# Altium schematic sheet MB1605-TOP.SchDoc: MB1605-TOP
size A3; Date: Not used; ApprovedBy: Not used; CheckedBy: Not used; Author: Not used; CompanyName: STMicroelectronics; DrawnBy: Not used; Engineer: Not used; Organization: Not used; Address1: Not used; Address2: Not used; Address3: Not used; Address4: Not used; DocumentNumber: Not used; Revision: Not used; SheetNumber: 2; SheetTotal: 18; CurrentTime: Not used; CurrentDate: Not used; Time: Not used; DocumentFullPathAndName: Not used; DocumentName: Not used; ModifiedDate: Not used; ImagePath: Not used; ProjectName: Not used; Application_BuildNumber: Not used
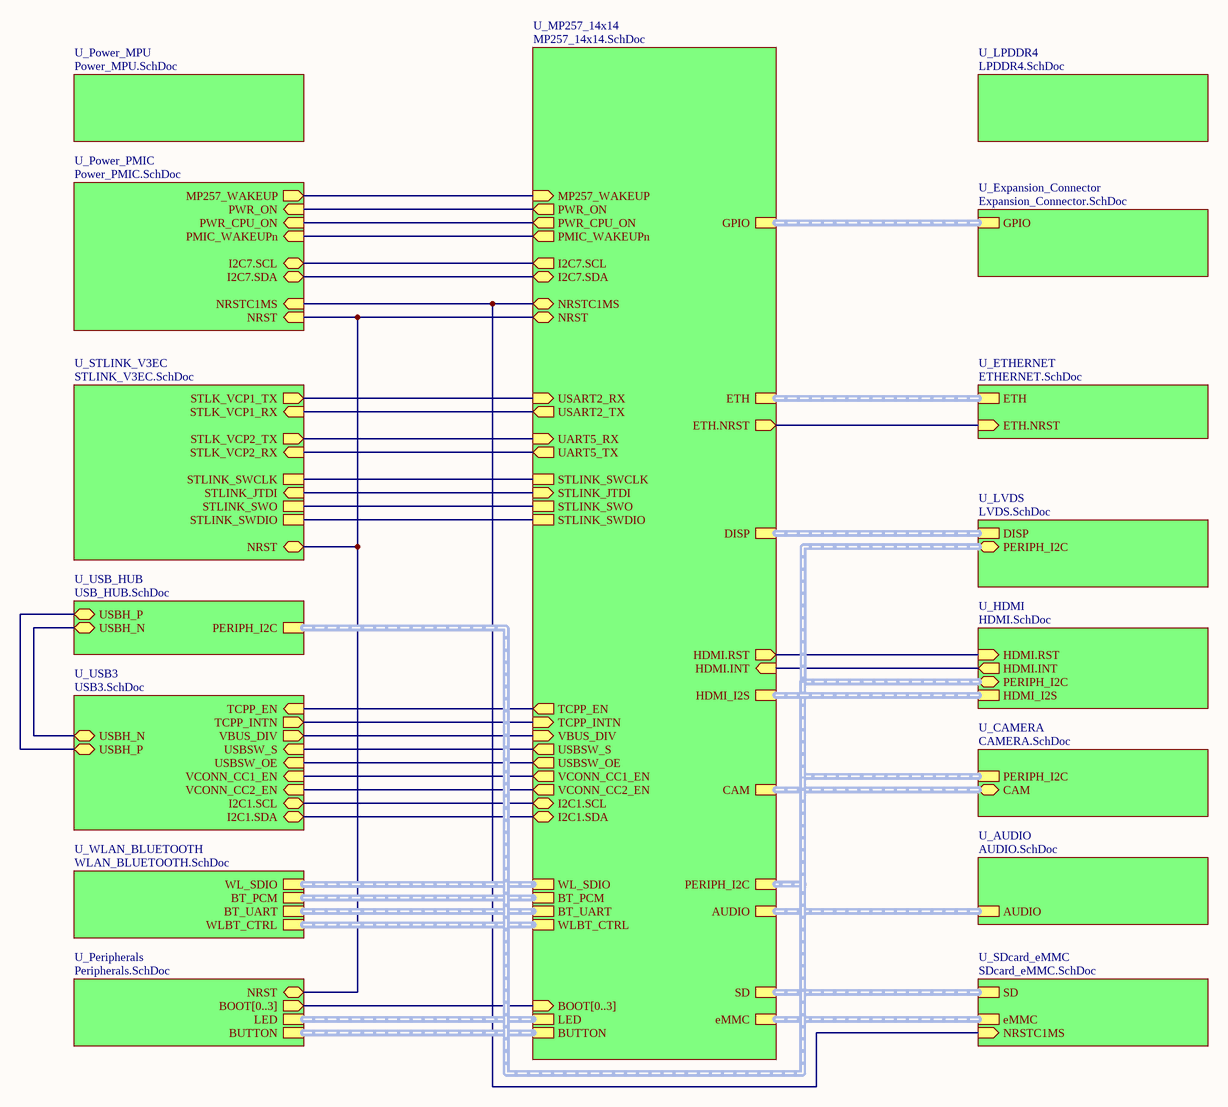
[diagram p0: MB1605-TOP.SchDoc]

## Sub-sheets
U_AUDIO = AUDIO.SchDoc: AUDIO (harness AUDIO)
U_CAMERA = CAMERA.SchDoc: CAM (bidir, harness CAMERA), PERIPH_I2C (harness PERIPH_I2C)
U_ETHERNET = ETHERNET.SchDoc: ETH.NRST (in), ETH (harness ETH1)
U_Expansion_Connector = Expansion_Connector.SchDoc: GPIO (harness GPIO)
U_HDMI = HDMI.SchDoc: HDMI.RST (in), HDMI.INT (out), PERIPH_I2C (bidir, harness PERIPH_I2C), HDMI_I2S (harness HDMI_I2S)
U_LPDDR4 = LPDDR4.SchDoc: no entries
U_LVDS = LVDS.SchDoc: DISP (harness DISP), PERIPH_I2C (bidir, harness PERIPH_I2C)
U_MP257_14x14 = MP257_14x14.SchDoc: NRST (bidir), PWR_ON (out), ETH (harness ETH1), BOOT[0..3] (in), LED (harness LED), BUTTON (harness BUTTON), UART5_TX (out), UART5_RX (in), STLINK_SWCLK, STLINK_JTDI (in), STLINK_SWO, STLINK_SWDIO, USART2_RX (in), NRSTC1MS (bidir), VBUS_DIV (in), TCPP_INTN (in), GPIO (harness GPIO), I2C7.SDA (bidir), I2C7.SCL (out), USART2_TX (out), DISP (harness DISP), PERIPH_I2C (harness PERIPH_I2C), ETH.NRST (out), I2C1.SCL (bidir), HDMI_I2S (harness HDMI_I2S), I2C1.SDA (bidir), PWR_CPU_ON (out), CAM (harness CAMERA), SD (harness SD), WL_SDIO (harness WL_SDIO), BT_PCM (harness BT_PCM), WLBT_CTRL (harness WL_BT_CTRL), BT_UART (harness BT_UART), AUDIO (harness AUDIO), MP257_WAKEUP (in), PMIC_WAKEUPn (out), HDMI.INT (in), HDMI.RST (out), USBSW_OE (out), USBSW_S (out), eMMC (harness eMMC), TCPP_EN (out), VCONN_CC1_EN (out), VCONN_CC2_EN (out)
U_Peripherals = Peripherals.SchDoc: NRST (bidir), BOOT[0..3] (out), LED (harness LED), BUTTON (harness BUTTON)
U_Power_MPU = Power_MPU.SchDoc: no entries
U_Power_PMIC = Power_PMIC.SchDoc: PMIC_WAKEUPn (in), NRST (in), I2C7.SCL (bidir), PWR_ON (in), PWR_CPU_ON (in), NRSTC1MS (in), I2C7.SDA (bidir), MP257_WAKEUP (out)
U_SDcard_eMMC = SDcard_eMMC.SchDoc: SD (harness SD), eMMC (harness eMMC), NRSTC1MS (in)
U_STLINK_V3EC = STLINK_V3EC.SchDoc: NRST (bidir), STLK_VCP2_TX (out), STLK_VCP2_RX (in), STLK_VCP1_TX (out), STLK_VCP1_RX (in), STLINK_SWO, STLINK_SWDIO, STLINK_SWCLK, STLINK_JTDI (in)
U_USB3 = USB3.SchDoc: TCPP_INTN (out), I2C1.SDA (bidir), I2C1.SCL (bidir), VBUS_DIV (out), USBH_P (bidir), USBH_N (bidir), USBSW_OE (in), USBSW_S (in), TCPP_EN (in), VCONN_CC1_EN (in), VCONN_CC2_EN (in)
U_USB_HUB = USB_HUB.SchDoc: USBH_P (bidir), USBH_N (bidir), PERIPH_I2C (harness PERIPH_I2C)
U_WLAN_BLUETOOTH = WLAN_BLUETOOTH.SchDoc: BT_PCM (harness BT_PCM), BT_UART (harness BT_UART), WL_SDIO (harness WL_SDIO), WLBT_CTRL (harness WL_BT_CTRL)

## Nets
(unnamed): sheet U_Peripherals/NRST, sheet U_MP257_14x14/NRST, sheet U_Power_PMIC/NRST, sheet U_STLINK_V3EC/NRST
(unnamed): sheet U_MP257_14x14/PWR_ON, sheet U_Power_PMIC/PWR_ON
(unnamed): sheet U_MP257_14x14/UART5_TX, sheet U_STLINK_V3EC/STLK_VCP2_RX
(unnamed): sheet U_MP257_14x14/UART5_RX, sheet U_STLINK_V3EC/STLK_VCP2_TX
(unnamed): sheet U_MP257_14x14/STLINK_SWCLK, sheet U_STLINK_V3EC/STLINK_SWCLK
(unnamed): sheet U_MP257_14x14/STLINK_JTDI, sheet U_STLINK_V3EC/STLINK_JTDI
(unnamed): sheet U_MP257_14x14/STLINK_SWO, sheet U_STLINK_V3EC/STLINK_SWO
(unnamed): sheet U_MP257_14x14/STLINK_SWDIO, sheet U_STLINK_V3EC/STLINK_SWDIO
(unnamed): sheet U_MP257_14x14/USART2_RX, sheet U_STLINK_V3EC/STLK_VCP1_TX
(unnamed): sheet U_MP257_14x14/NRSTC1MS, sheet U_Power_PMIC/NRSTC1MS, sheet U_SDcard_eMMC/NRSTC1MS
(unnamed): sheet U_MP257_14x14/VBUS_DIV, sheet U_USB3/VBUS_DIV
(unnamed): sheet U_MP257_14x14/TCPP_INTN, sheet U_USB3/TCPP_INTN
(unnamed): sheet U_MP257_14x14/I2C7.SDA, sheet U_Power_PMIC/I2C7.SDA
(unnamed): sheet U_MP257_14x14/I2C7.SCL, sheet U_Power_PMIC/I2C7.SCL
(unnamed): sheet U_MP257_14x14/USART2_TX, sheet U_STLINK_V3EC/STLK_VCP1_RX
(unnamed): sheet U_MP257_14x14/ETH.NRST, sheet U_ETHERNET/ETH.NRST
(unnamed): sheet U_MP257_14x14/I2C1.SCL, sheet U_USB3/I2C1.SCL
(unnamed): sheet U_MP257_14x14/I2C1.SDA, sheet U_USB3/I2C1.SDA
(unnamed): sheet U_MP257_14x14/PWR_CPU_ON, sheet U_Power_PMIC/PWR_CPU_ON
(unnamed): sheet U_MP257_14x14/MP257_WAKEUP, sheet U_Power_PMIC/MP257_WAKEUP
(unnamed): sheet U_MP257_14x14/PMIC_WAKEUPn, sheet U_Power_PMIC/PMIC_WAKEUPn
(unnamed): sheet U_MP257_14x14/HDMI.INT, sheet U_HDMI/HDMI.INT
(unnamed): sheet U_MP257_14x14/HDMI.RST, sheet U_HDMI/HDMI.RST
(unnamed): sheet U_MP257_14x14/USBSW_OE, sheet U_USB3/USBSW_OE
(unnamed): sheet U_MP257_14x14/USBSW_S, sheet U_USB3/USBSW_S
(unnamed): sheet U_MP257_14x14/TCPP_EN, sheet U_USB3/TCPP_EN
(unnamed): sheet U_MP257_14x14/VCONN_CC1_EN, sheet U_USB3/VCONN_CC1_EN
(unnamed): sheet U_MP257_14x14/VCONN_CC2_EN, sheet U_USB3/VCONN_CC2_EN
(unnamed): sheet U_USB_HUB/USBH_P, sheet U_USB3/USBH_P
(unnamed): sheet U_USB_HUB/USBH_N, sheet U_USB3/USBH_N

## Buses and harness runs
bus sheet U_MP257_14x14/BOOT[0..3] = sheet U_Peripherals/BOOT[0..3]
harness sheet U_AUDIO/AUDIO = sheet U_MP257_14x14/AUDIO
harness sheet U_CAMERA/CAM = sheet U_MP257_14x14/CAM
harness sheet U_CAMERA/PERIPH_I2C = sheet U_HDMI/PERIPH_I2C = sheet U_LVDS/PERIPH_I2C = sheet U_MP257_14x14/PERIPH_I2C = sheet U_USB_HUB/PERIPH_I2C
harness sheet U_ETHERNET/ETH = sheet U_MP257_14x14/ETH
harness sheet U_Expansion_Connector/GPIO = sheet U_MP257_14x14/GPIO
harness sheet U_HDMI/HDMI_I2S = sheet U_MP257_14x14/HDMI_I2S
harness sheet U_LVDS/DISP = sheet U_MP257_14x14/DISP
harness sheet U_MP257_14x14/BT_PCM = sheet U_WLAN_BLUETOOTH/BT_PCM
harness sheet U_MP257_14x14/BT_UART = sheet U_WLAN_BLUETOOTH/BT_UART
harness sheet U_MP257_14x14/BUTTON = sheet U_Peripherals/BUTTON
harness sheet U_MP257_14x14/eMMC = sheet U_SDcard_eMMC/eMMC
harness sheet U_MP257_14x14/LED = sheet U_Peripherals/LED
harness sheet U_MP257_14x14/SD = sheet U_SDcard_eMMC/SD
harness sheet U_MP257_14x14/WL_SDIO = sheet U_WLAN_BLUETOOTH/WL_SDIO
harness sheet U_MP257_14x14/WLBT_CTRL = sheet U_WLAN_BLUETOOTH/WLBT_CTRL

## Notes on the sheet
- Title:
- Project:
- Size:
- Revision:
- Variant:
- A3
- -
- Date:
- Reference:
- Sheet:
- of